# Altium schematic sheet Master.SchDoc
size A; DocumentNumber: 1; SheetNumber: 1; SheetTotal: 7
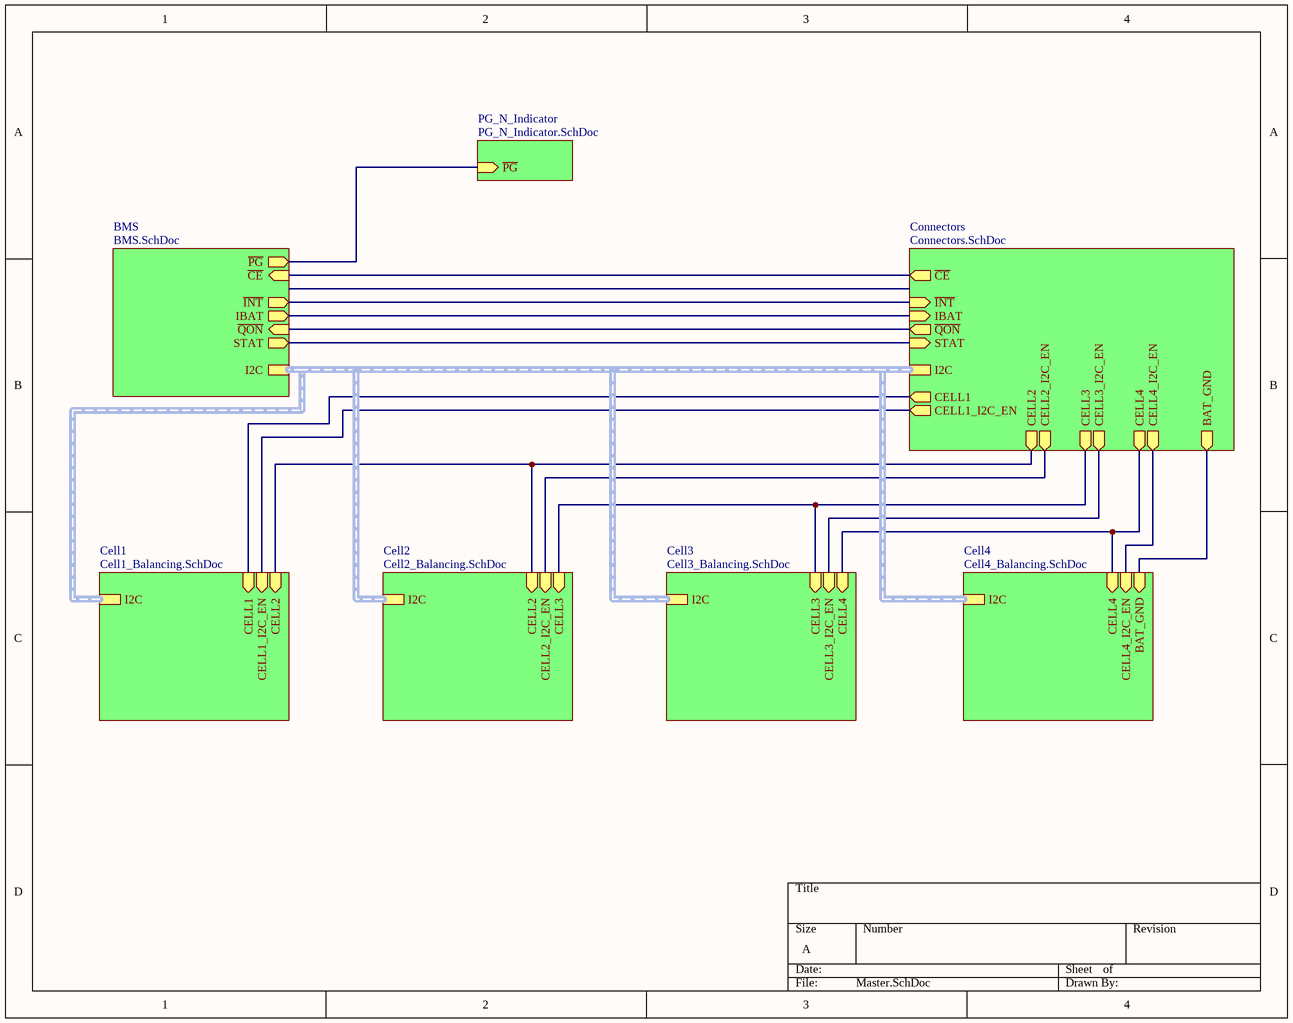
[diagram p0: Master.SchDoc]

## Sub-sheets
BMS = BMS.SchDoc: ~{CE} (in), I2C (harness I2C), ~{INT} (out), IBAT (out), ~{QON} (in), STAT (out), ~{PG} (out)
Cell1 = Cell1_Balancing.SchDoc: I2C (harness I2C), CELL1 (in), CELL2 (in), CELL1_I2C_EN (in)
Cell2 = Cell2_Balancing.SchDoc: I2C (harness I2C), CELL3 (in), CELL2_I2C_EN (in), CELL2 (in)
Cell3 = Cell3_Balancing.SchDoc: I2C (harness I2C), CELL4 (in), CELL3_I2C_EN (in), CELL3 (in)
Cell4 = Cell4_Balancing.SchDoc: BAT_GND (in), CELL4_I2C_EN (in), CELL4 (in), I2C (harness I2C)
Connectors = Connectors.SchDoc: ~{CE} (out), I2C (harness I2C), ~{INT} (in), IBAT (in), ~{QON} (out), STAT (in), CELL1_I2C_EN (out), CELL1 (out), CELL2_I2C_EN (out), CELL2 (out), CELL3_I2C_EN (out), CELL3 (out), CELL4_I2C_EN (out), CELL4 (out), BAT_GND (out)
PG_N_Indicator = PG_N_Indicator.SchDoc: ~{PG} (in)

## Nets
(unnamed): sheet BMS/~{CE}, sheet Connectors/~{CE}
(unnamed): sheet BMS/~{INT}, sheet Connectors/~{INT}
(unnamed): sheet BMS/IBAT, sheet Connectors/IBAT
(unnamed): sheet BMS/~{QON}, sheet Connectors/~{QON}
(unnamed): sheet BMS/STAT, sheet Connectors/STAT
(unnamed): sheet BMS/~{PG}, sheet PG_N_Indicator/~{PG}
(unnamed): sheet Connectors/CELL1_I2C_EN, sheet Cell1/CELL1_I2C_EN
(unnamed): sheet Connectors/CELL1, sheet Cell1/CELL1
(unnamed): sheet Connectors/CELL2_I2C_EN, sheet Cell2/CELL2_I2C_EN
(unnamed): sheet Connectors/CELL2, sheet Cell1/CELL2, sheet Cell2/CELL2
(unnamed): sheet Connectors/CELL3_I2C_EN, sheet Cell3/CELL3_I2C_EN
(unnamed): sheet Connectors/CELL3, sheet Cell2/CELL3, sheet Cell3/CELL3
(unnamed): sheet Connectors/CELL4_I2C_EN, sheet Cell4/CELL4_I2C_EN
(unnamed): sheet Connectors/CELL4, sheet Cell3/CELL4, sheet Cell4/CELL4
(unnamed): sheet Connectors/BAT_GND, sheet Cell4/BAT_GND

## Buses and harness runs
harness sheet BMS/I2C = sheet Cell1/I2C = sheet Cell2/I2C = sheet Cell3/I2C = sheet Cell4/I2C = sheet Connectors/I2C